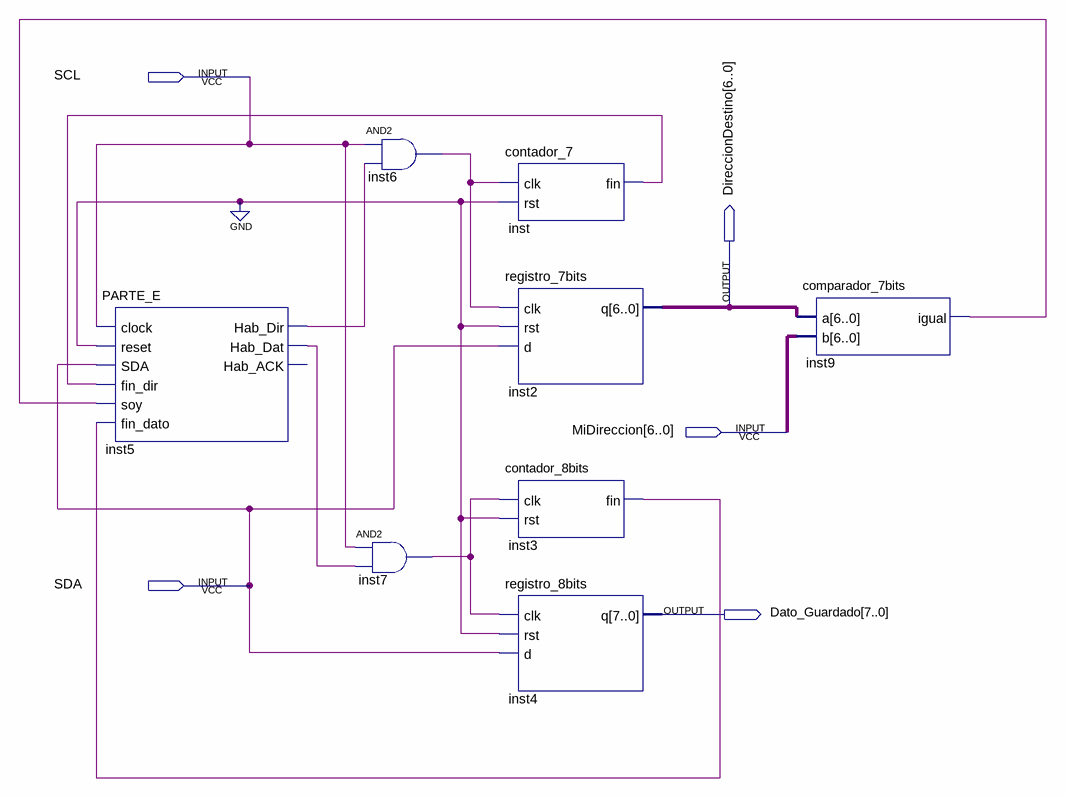
[diagram p0: schematic sheet]
// Quartus schematic Circuito_Final.bdf as structural Verilog: 8 symbols, 5 pins
module Circuito_Final (
  input  SCL,
  input  [6:0] MiDireccion,
  input  SDA,
  output [6:0] DireccionDestino,
  output [7:0] Dato_Guardado
);

  wire inst3_fin, inst5_hab_dat, inst5_hab_dir, inst6_out, inst7_out, inst9_igual, inst_fin;

  PARTE_E inst5 (
    .clock(SCL), .reset(1'b0), .SDA(SDA), .fin_dir(inst_fin), .soy(inst9_igual), .fin_dato(inst3_fin),
    .Hab_Dir(inst5_hab_dir), .Hab_Dat(inst5_hab_dat));  // open: Hab_ACK
  and inst6 (inst6_out, SCL, inst5_hab_dir);
  and inst7 (inst7_out, SCL, inst5_hab_dat);
  contador_7 inst (.clk(inst6_out), .rst(1'b0), .fin(inst_fin));
  registro_7bits inst2 (.clk(inst6_out), .rst(1'b0), .d(SDA), .q(DireccionDestino));
  contador_8bits inst3 (.clk(inst7_out), .rst(1'b0), .fin(inst3_fin));
  registro_8bits inst4 (.clk(inst7_out), .rst(1'b0), .d(SDA), .q(Dato_Guardado));
  comparador_7bits inst9 (.a(DireccionDestino), .b(MiDireccion), .igual(inst9_igual));
endmodule
